# Altium schematic sheet DataPCB 2.1.SchDoc
size Tabloid portrait
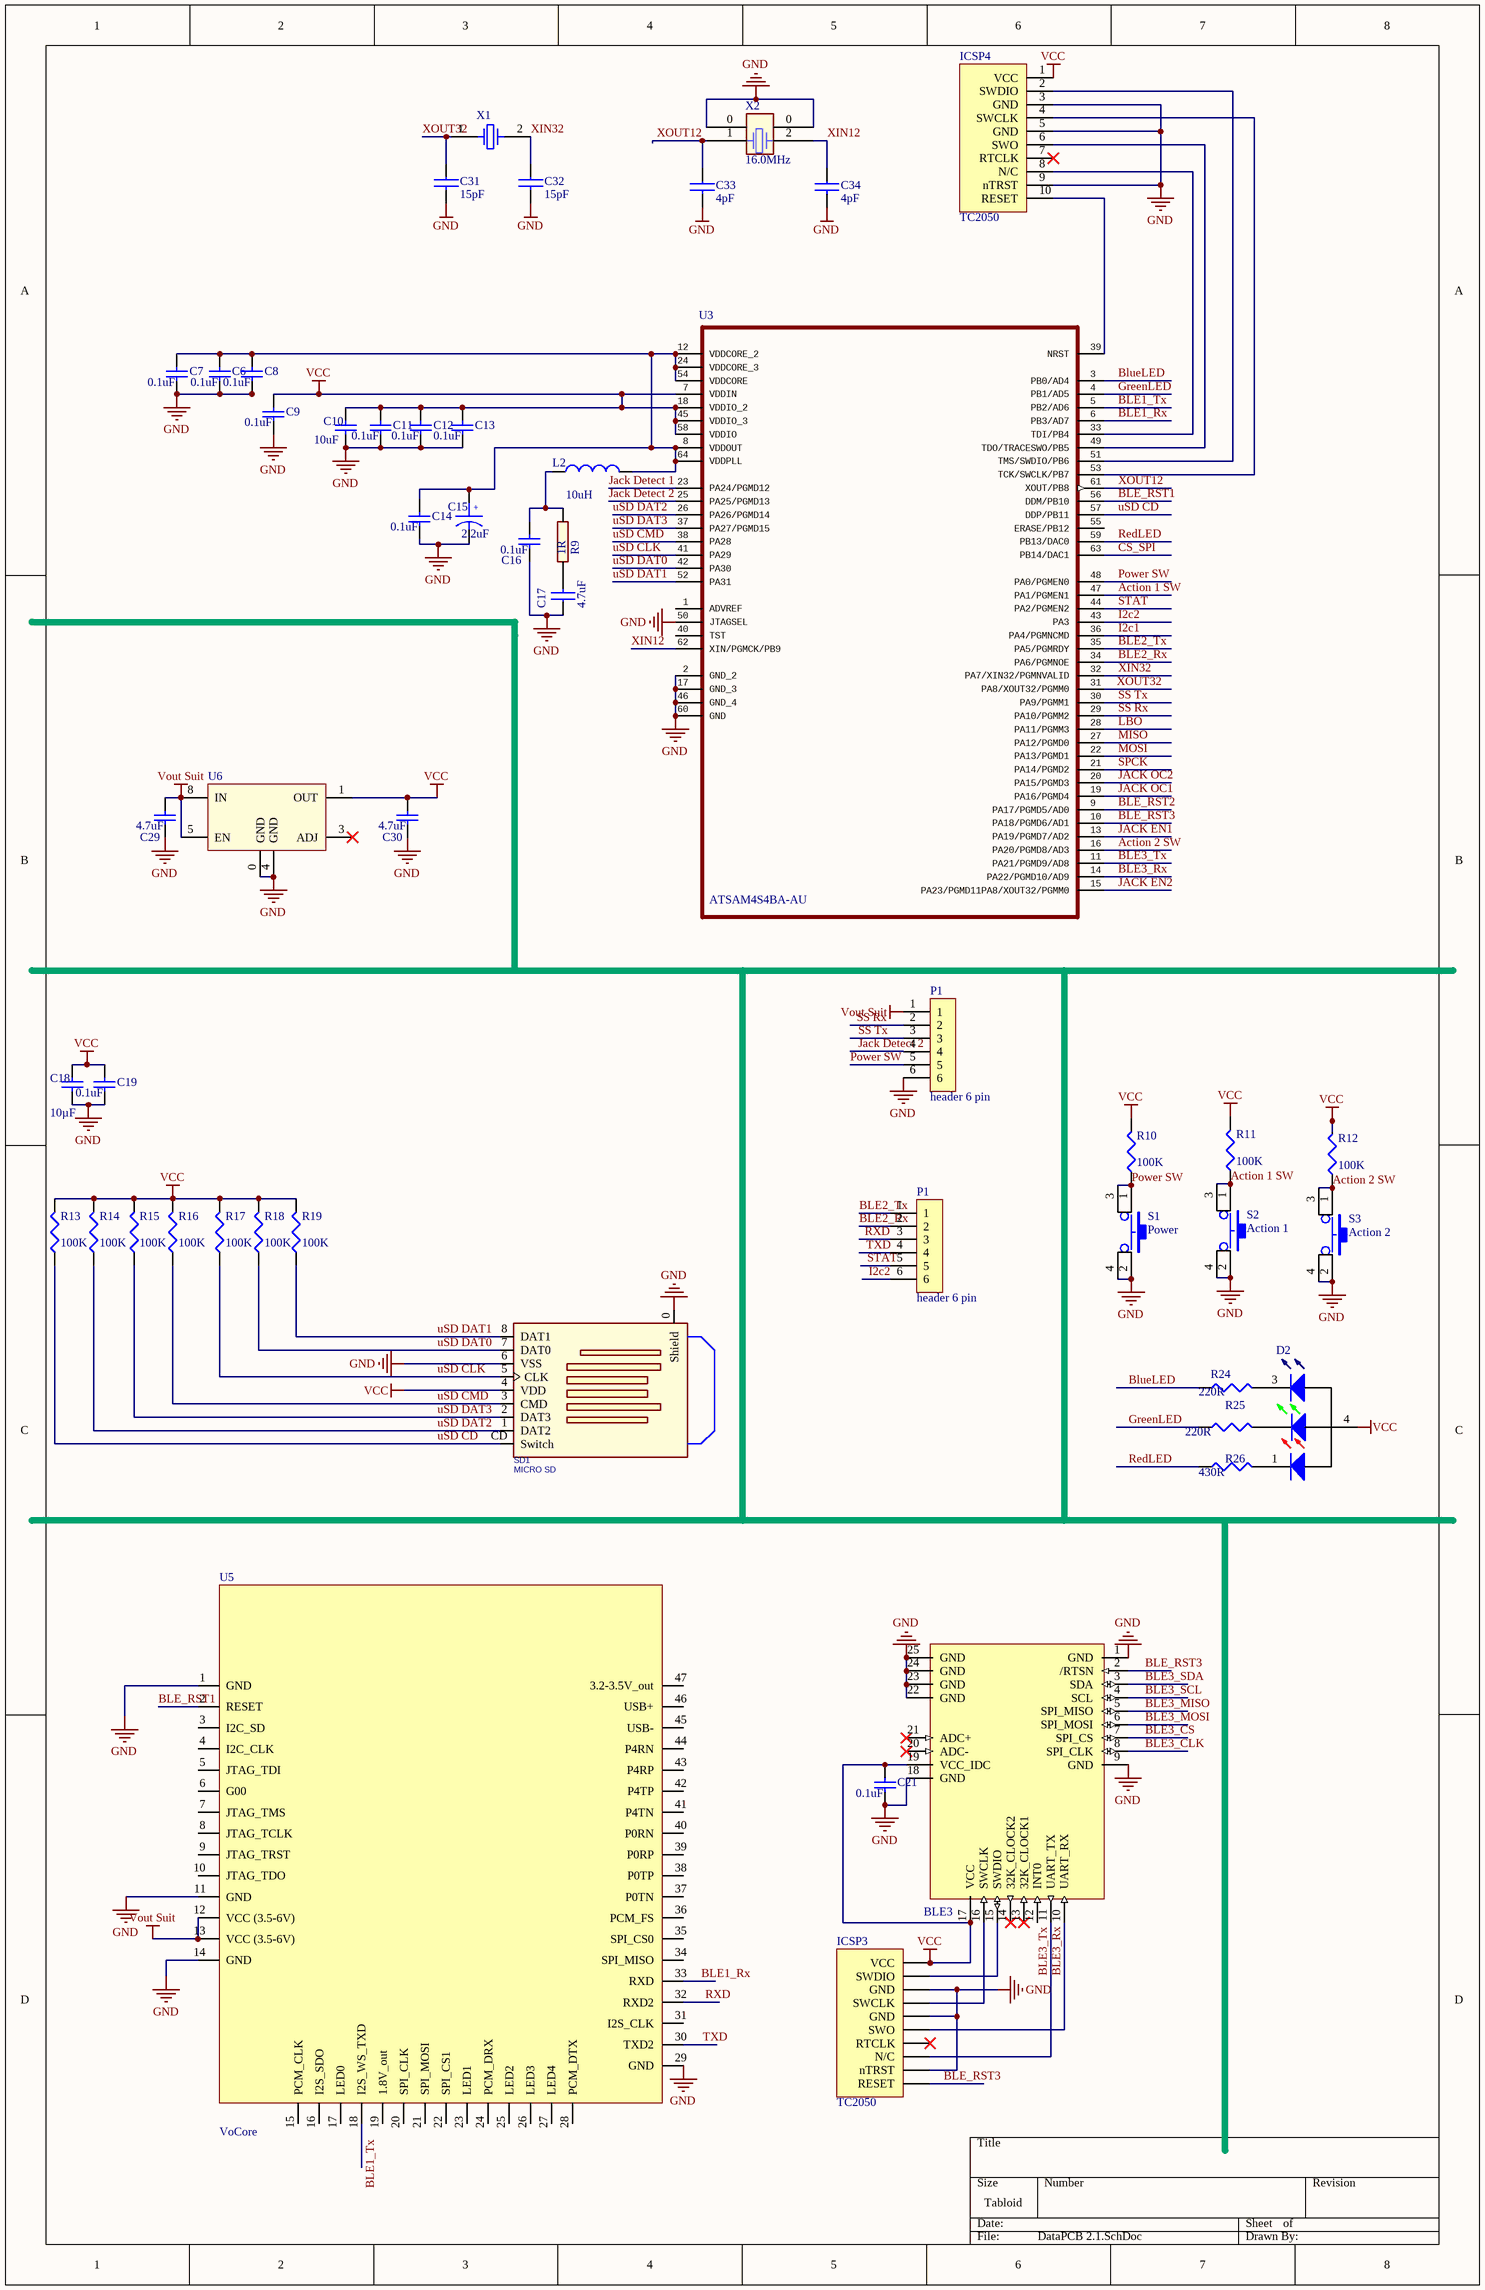
[diagram p0: DataPCB 2.1.SchDoc]

## Parts
(Parts that share a designator on the sheet are numbered #1, #2 ... from top to bottom, then left to right.)
BLE3  QS9322  [QS9322]  (value not drawn)
C6  value 0.1uF  [CAP 0402]
C7  value 0.1uF  [CAP 0402]
C8  value 0.1uF  [CAP 0402]
C9  value 0.1uF  [CAP 0402]
C10  value 10uF  [0603]
C11  value 0.1uF  [CAP 0402]
C12  value 0.1uF  [CAP 0402]
C13  value 0.1uF  [CAP 0402]
C14  value 0.1uF  [CAP 0402]
C15  value 2.2uF  [0805]
C16  value 0.1uF  [CAP 0402]
C17  value 4.7uF  [CAP 0402]
C18  value 10µF  [0603]
C19  value 0.1uF  [CAP 0402]
C21  value 0.1uF  [CAP 0402]
C29  value 4.7uF  [0603]
C30  value 4.7uF  [0603]
C31  value 15pF  [CAP 0402]
C32  value 15pF  [CAP 0402]
C33  4pF  [0603]
C34  4pF  [0603]
D2  LED2_RGB  [LED RGB]  (value not drawn)
ICSP3  TC2050  [TC2050-IDC-NL]
ICSP4  TC2050  [TC2050-IDC-NL]
L2  value 10uH  [0603]
P1#1  header 6 pin  [Header 6 1.27mm]
P1#2  header 6 pin  [Header 6 1.27mm]
R9  value 1R  [RES 0402]
R10  value 100K  [RES 0402]
R11  value 100K  [RES 0402]
R12  value 100K  [RES 0402]
R13  value 100K  [RES 0402]
R14  value 100K  [RES 0402]
R15  value 100K  [RES 0402]
R16  value 100K  [RES 0402]
R17  value 100K  [RES 0402]
R18  value 100K  [RES 0402]
R19  value 100K  [RES 0402]
R24  value 220R  [0603]
R25  value 220R  [0603]
R26  value 430R  [0603]
S1  Power  [Tac Sw RA SMT]
S2  Action 1  [Tac Sw RA SMT]
S3  Action 2  [Tac Sw RA SMT]
SD1  MICRO SD  [MICRO_SD_SMK]
U3  Manufacturer Part Number: ATSAM4S4BA-AU  [QFP50P1200X1200X160-64N]  (hidden comment: Flash MCU)
U5  VoCore  [VoCore]
U6  (no value)  [DFN8 U-DFN3030-8]
X1  Xtal 32  [Xtal smd 32khz - larger]  (value not drawn)
X2  value 16.0MHz  [Xtal smd 3.2X2.5]  (hidden comment: Xtal 16)

## Nets
GND: BLE3.1(GND) BLE3.9(GND) BLE3.18(GND) BLE3.22(GND) BLE3.23(GND) BLE3.24(GND) BLE3.25(GND) C6.2 C7.2 C8.2 C9.2 C10.2 C11.2 C12.2 C13.2 C14.2 C15.2 C16.2 C17.1 C18.2 C19.2 C21.2 C29.2 C30.2 C31.2 C32.2 C33.2 C34.2 ICSP3.3(GND) ICSP3.5(GND) ICSP3.9(nTRST) ICSP4.3(GND) ICSP4.5(GND) ICSP4.9(nTRST) P1#1.6 S1.2 S1.4 S2.2 S2.4 S3.2 S3.4 SD1.0(Shield) SD1.6(VSS) U3.2(GND_2) U3.17(GND_3) U3.46(GND_4) U3.50(JTAGSEL) U3.60(GND) U5.1(GND) U5.11(GND) U5.14(GND) U5.29(GND) U6.0(GND) U6.4(GND) X2.0
VCC: BLE3.17(VCC) BLE3.19(VCC_IDC) C9.1 C10.1 C11.1 C12.1 C13.1 C18.1 C19.1 C21.1 C30.1 D2.4 ICSP3.1(VCC) ICSP4.1(VCC) R10.2 R11.2 R12.2 R13.2 R14.2 R15.2 R16.2 R17.2 R18.2 R19.2 SD1.4(VDD) U3.7(VDDIN) U3.18(VDDIO_2) U3.45(VDDIO_3) U3.58(VDDIO) U6.1(OUT)
Vout Suit: C29.1 P1#1.1 U5.12(VCC_(3.5-6V)) U5.13(VCC_(3.5-6V)) U6.5(EN) U6.8(IN)
Action 1 SW: R11.1 S2.1 S2.3 U3.47(PA1/PGMEN1)
Action 2 SW: R12.1 S3.1 S3.3 U3.16(PA20/PGMD8/AD3)
BLE1_Rx: U3.6(PB3/AD7) U5.33(RXD)
BLE1_Tx: U3.5(PB2/AD6) U5.18(I2S_WS_TXD)
BLE2_Rx: P1#2.2 U3.34(PA6/PGMNOE)
BLE2_Tx: P1#2.1 U3.35(PA5/PGMRDY)
BLE3_CLK: BLE3.8(SPI_CLK)
BLE3_CS: BLE3.7(SPI_CS)
BLE3_MISO: BLE3.5(SPI_MISO)
BLE3_MOSI: BLE3.6(SPI_MOSI)
BLE3_Rx: BLE3.10(UART_RX) ICSP3.6(SWO) U3.14(PA22/PGMD10/AD9)
BLE3_SCL: BLE3.4(SCL)
BLE3_SDA: BLE3.3(SDA)
BLE3_Tx: BLE3.11(UART_TX) ICSP3.8(N/C) U3.11(PA21/PGMD9/AD8)
BLE_RST1: U3.56(DDM/PB10) U5.2(RESET)
BLE_RST2: U3.9(PA17/PGMD5/AD0)
BLE_RST3: BLE3.2(/RTSN) ICSP3.10(RESET) U3.10(PA18/PGMD6/AD1)
BlueLED: R24.1 U3.3(PB0/AD4)
CS_SPI: U3.63(PB14/DAC1)
GreenLED: R25.1 U3.4(PB1/AD5)
I2c1: U3.36(PA4/PGMNCMD)
I2c2: P1#2.6 U3.43(PA3)
Jack Detect 1: U3.23(PA24/PGMD12)
Jack Detect 2: P1#1.4 U3.25(PA25/PGMD13)
JACK EN1: U3.13(PA19/PGMD7/AD2)
JACK EN2: U3.15(PA23/PGMD11PA8/XOUT32/PGMM0)
JACK OC1: U3.19(PA16/PGMD4)
JACK OC2: U3.20(PA15/PGMD3)
LBO: U3.28(PA11/PGMM3)
MISO: U3.27(PA12/PGMD0)
MOSI: U3.22(PA13/PGMD1)
Power SW: P1#1.5 R10.1 S1.1 S1.3 U3.48(PA0/PGMEN0)
RedLED: R26.1 U3.59(PB13/DAC0)
RXD: P1#2.3 U5.32(RXD2)
SPCK: U3.21(PA14/PGMD2)
SS Rx: P1#1.2 U3.29(PA10/PGMM2)
SS Tx: P1#1.3 U3.30(PA9/PGMM1)
STAT: P1#2.5 U3.44(PA2/PGMEN2)
TXD: P1#2.4 U5.30(TXD2)
uSD CD: R13.1 SD1.CD(Switch) U3.57(DDP/PB11)
uSD CLK: R17.1 SD1.5(CLK) U3.41(PA29)
uSD CMD: R16.1 SD1.3(CMD) U3.38(PA28)
uSD DAT0: R18.1 SD1.7(DAT0) U3.42(PA30)
uSD DAT1: R19.1 SD1.8(DAT1) U3.52(PA31)
uSD DAT2: R14.1 SD1.1(DAT2) U3.26(PA26/PGMD14)
uSD DAT3: R15.1 SD1.2(DAT3) U3.37(PA27/PGMD15)
XIN12: C34.1 U3.62(XIN/PGMCK/PB9) X2.2
XIN32: C32.1 U3.32(PA7/XIN32/PGMNVALID) X1.2
XOUT12: C33.1 U3.61(XOUT/PB8) X2.1
XOUT32: C31.1 U3.31(PA8/XOUT32/PGMM0) X1.1
NetBLE3_15: BLE3.15(SWDIO) ICSP3.2(SWDIO)
NetBLE3_16: BLE3.16(SWCLK) ICSP3.4(SWCLK)
NetC6_1: C6.1 C7.1 C8.1 C14.1 C15.1 L2.2 U3.8(VDDOUT) U3.12(VDDCORE_2) U3.24(VDDCORE_3) U3.54(VDDCORE) U3.64(VDDPLL)
NetC16_1: C16.1 L2.1 R9.2
NetC17_2: C17.2 R9.1
NetD2_1: D2.1 R26.2
NetD2_2: D2.2 R25.2
NetD2_3: D2.3 R24.2
NetICSP4_2: ICSP4.2(SWDIO) U3.51(TMS/SWDIO/PB6)
NetICSP4_4: ICSP4.4(SWCLK) U3.53(TCK/SWCLK/PB7)
NetICSP4_6: ICSP4.6(SWO) U3.49(TDO/TRACESWO/PB5)
NetICSP4_8: ICSP4.8(N/C) U3.33(TDI/PB4)
NetICSP4_10: ICSP4.10(RESET) U3.39(NRST)

Not connected (* = marked no-connect by the designer): BLE3 12(INT0) 13(32K_CLOCK1)* 14(32K_CLOCK2)* 20(ADC-)* 21(ADC+)*; ICSP3 7(RTCLK)*; ICSP4 7(RTCLK)*; U3 1(ADVREF) 40(TST) 55(ERASE/PB12); U5 3(I2C_SD) 4(I2C_CLK) 5(JTAG_TDI) 6(G00) 7(JTAG_TMS) 8(JTAG_TCLK) 9(JTAG_TRST) 10(JTAG_TDO) 15(PCM_CLK) 16(I2S_SDO) 17(LED0) 19(1.8V_out) 20(SPI_CLK) 21(SPI_MOSI) 22(SPI_CS1) 23(LED1) 24(PCM_DRX) 25(LED2) 26(LED3) 27(LED4) 28(PCM_DTX) 31(I2S_CLK) 34(SPI_MISO) 35(SPI_CS0) 36(PCM_FS) 37(P0TN) 38(P0TP) 39(P0RP) 40(P0RN) 41(P4TN) 42(P4TP) 43(P4RP) 44(P4RN) 45(USB-) 46(USB+) 47(3.2-3.5V_out); U6 2(NC) 3(ADJ)* 6(NC) 7(NC)

## Notes on the sheet
- (in symbol A01-0492) +

## Library data of the parts
BLE3 = QS9322: QS9322 Bluetooth 4.0 Low Energy Module; Manufacturer Part Number: QS9322
C6-C9 C11-C14 C16 C19 C21 = Cap: Manufacturer: Yageo; Manufacturer Part Number: CC0402KRX5R6BB104; Capacitance: 0.1µF; Temperature Coefficient: X5R; Voltage - Rated: 10V; Tolerance: ±10%; Thickness (Max): 0.022" (0.55mm); Lead Style: -; Supplier: Digi-Key; Supplier Part Number: 311-1336-1-ND; Lead Spacing: -; Packaging: Cut Tape (CT); Category: Capacitors; Applications: General Purpose; RoHS: RoHS Compliant; Features: -; Operating Temperature: -55°C ~ 85°C; Ratings: -; Package / Case: 0402 (1005 Metric); Mounting Type: Surface Mount, MLCC; Size / Dimension: 0.039" L x 0.020" W (1.00mm x 0.50mm); Height - Seated (Max): -; ComponentLink1URL: http://www.yageo.com/documents/recent/UPY-GPHC_X5R_4V-to-50V_19.pdf; ComponentLink1Description: http://www.yageo.com/documents/recent/UPY-GPHC_X5R_4V-to-50V_19.pdf; Pricing: 1=0.14, 10=0.014, 25=0.01, 100=0.0067, 250=0.00548, 500=0.00468, 1000=0.00365, 2500=0.00328, 5000=0.00304 (CAD)
C10 = Cap: Manufacturer Part Number: GRM188R61C106MA73D; Manufacturer: Murata Electronics North America; Capacitance: 10µF; Temperature Coefficient: X5R; Voltage - Rated: 16V; Tolerance: ±20%; Lead Spacing: -; Applications: General Purpose; Height - Seated (Max): -; Supplier Part Number: 490-7201-1-ND; Package / Case: 0603 (1608 Metric); Mounting Type: Surface Mount, MLCC; Lead Style: -; Packaging: Cut Tape (CT); Operating Temperature: -55°C ~ 85°C; Category: Capacitors; Size / Dimension: 0.063" L x 0.031" W (1.60mm x 0.80mm); Ratings: -; Supplier: Digi-Key; Thickness (Max): 0.031" (0.80mm); RoHS: RoHS Compliant; Features: -; ComponentLink1URL: http://www.murata.com/~/media/webrenewal/support/library/catalog/products/capacitor/mlcc/c02e.ashx; ComponentLink1Description: http://www.murata.com/~/media/webrenewal/support/library/catalog/products/capacitor/mlcc/c02e.ashx; Pricing: 1=0.25, 10=0.234, 25=0.1996, 50=0.1698, 100=0.1632, 250=0.14652, 500=0.13986, 1000=0.11655 (CAD)
C15 = A01-0492: Manufacturer Size Code: P; Manufacturer: AVX Corporation; Manufacturer Part Number: F921A225MPA; Tolerance: ±20%; Type: Molded; ESR (Equivalent Series Resistance): 12 Ohm; Capacitance: 2.2µF; Voltage - Rated: 10V; Category: Capacitors; Size / Dimension: 0.079" L x 0.049" W (2.00mm x 1.25mm); RoHS: RoHS Compliant; Operating Temperature: -55°C ~ 125°C; Mounting Type: Surface Mount; Package / Case: 0805 (2012 Metric); Height - Seated (Max): 0.039" (1.00mm); Lifetime @ Temp.: -; Supplier: Digi-Key; Packaging: Cut Tape (CT); Features: General Purpose; Lead Spacing: -; Supplier Part Number: 478-8123-1-ND; ComponentLink1URL: http://www.avx.com/docs/Catalogs/f92.pdf; ComponentLink1Description: http://www.avx.com/docs/Catalogs/f92.pdf; Pricing: 1=0.45, 10=0.397, 100=0.1983, 250=0.15856, 500=0.14442, 1000=0.13025 (CAD)
C17 = A01-0046: Manufacturer: Murata Electronics North America; Manufacturer Part Number: ZRB15XR61A475ME01D; Temperature Coefficient: X5R; Voltage - Rated: 10V; Capacitance: 4.7µF; Tolerance: ±20%; Features: -; Lead Style: -; Mounting Type: Surface Mount, MLCC; Applications: General Purpose; Ratings: -; Height - Seated (Max): -; Supplier Part Number: 490-10984-1-ND; Package / Case: 0402 (1005 Metric); Supplier: Digi-Key; Thickness (Max): 0.031" (0.80mm); Category: Capacitors; RoHS: RoHS Compliant; Size / Dimension: 0.039" L x 0.020" W (1.00mm x 0.50mm); Lead Spacing: -; Packaging: Cut Tape (CT); Operating Temperature: -55°C ~ 85°C; ComponentLink1URL: http://search.murata.co.jp/Ceramy/image/img/A01X/G101/ENG/ZRB15XR61A475ME01-01.pdf; ComponentLink1Description: http://search.murata.co.jp/Ceramy/image/img/A01X/G101/ENG/ZRB15XR61A475ME01-01.pdf; Pricing: 1=0.5, 10=0.418, 50=0.2354, 100=0.2092, 250=0.15688, 500=0.1386, 1000=0.12289 (CAD)
C18 = Cap: Manufacturer Part Number: GRM188R61C106MA73D; Manufacturer: Murata Electronics North America; Voltage - Rated: 16V; Temperature Coefficient: X5R; Tolerance: ±20%; Pricing: 1=0.25, 10=0.234, 25=0.1996, 50=0.1698, 100=0.1632, 250=0.14652, 500=0.13986, 1000=0.11655 (CAD); ComponentLink1URL: http://www.murata.com/~/media/webrenewal/support/library/catalog/products/capacitor/mlcc/c02e.ashx; ComponentLink1Description: http://www.murata.com/~/media/webrenewal/support/library/catalog/products/capacitor/mlcc/c02e.ashx; Lead Spacing: -; Capacitance: 10µF; Applications: General Purpose; Height - Seated (Max): -; Supplier Part Number: 490-7201-1-ND; Package / Case: 0603 (1608 Metric); Mounting Type: Surface Mount, MLCC; Lead Style: -; Packaging: Cut Tape (CT); Operating Temperature: -55°C ~ 85°C; Category: Capacitors; Size / Dimension: 0.063" L x 0.031" W (1.60mm x 0.80mm); Ratings: -; Supplier: Digi-Key; Thickness (Max): 0.031" (0.80mm); RoHS: RoHS Compliant; Features: -
C29 C30 = Cap: Manufacturer: Yageo; Manufacturer Part Number: CC0603KRX5R6BB475; Tolerance: ±10%; Capacitance: 4.7µF; Voltage - Rated: 10V; Temperature Coefficient: X5R; Published: 8-Jun-2000; LatestRevisionDate: 17-Jul-2002; LatestRevisionNote: Re-released for DXP Platform.; PackageReference: RAD-0.3; Publisher: Altium Limited; Features: -; Height - Seated (Max): -; Operating Temperature: -55°C ~ 85°C; Mounting Type: Surface Mount, MLCC; Category: Capacitors; RoHS: RoHS Compliant; Packaging: Cut Tape (CT); Supplier: Digi-Key; Thickness (Max): 0.035" (0.90mm); Supplier Part Number: 311-1455-1-ND; Ratings: -; Package / Case: 0603 (1608 Metric); Lead Style: -; Size / Dimension: 0.063" L x 0.031" W (1.60mm x 0.80mm); Applications: General Purpose; Lead Spacing: -; ComponentLink1URL: http://www.yageo.com/documents/recent/UPY-GPHC_X5R_4V-to-50V_19.pdf; ComponentLink1Description: http://www.yageo.com/documents/recent/UPY-GPHC_X5R_4V-to-50V_19.pdf; Pricing: 1=0.2, 10=0.133, 25=0.1, 100=0.0633, 250=0.05336, 500=0.04468, 1000=0.03669 (CAD)
C31 = A01-0013: Manufacturer Part Number: GJM1555C1H150JB01D; Manufacturer: Murata Electronics North America; Tolerance: ±5%; Voltage - Rated: 50V; Temperature Coefficient: C0G, NP0; Lead Style: -; Packaging: Cut Tape (CT); Height - Seated (Max): -; Capacitance: 15pF; Thickness (Max): 0.022" (0.55mm); Features: High Q, Low Loss; Ratings: -; Size / Dimension: 0.039" L x 0.020" W (1.00mm x 0.50mm); Operating Temperature: -55°C ~ 125°C; RoHS: RoHS Compliant; Mounting Type: Surface Mount, MLCC; Package / Case: 0402 (1005 Metric); Supplier Part Number: 490-3117-1-ND; Category: Capacitors; Applications: RF, Microwave, High Frequency; Lead Spacing: -; Supplier: Digi-Key
C32 = A01-0013: Manufacturer Part Number: GJM1555C1H150JB01D; Manufacturer: Murata Electronics North America; Voltage Rating DC: 50 V; Tolerance: ±5%; Voltage - Rated: 50V; Temperature Coefficient: C0G, NP0; Lead Style: -; Packaging: Cut Tape (CT); Height - Seated (Max): -; Capacitance: 15pF; Thickness (Max): 0.022" (0.55mm); Features: High Q, Low Loss; Ratings: -; Size / Dimension: 0.039" L x 0.020" W (1.00mm x 0.50mm); Operating Temperature: -55°C ~ 125°C; RoHS: RoHS Compliant; Mounting Type: Surface Mount, MLCC; Package / Case: 0402 (1005 Metric); Supplier Part Number: 490-3117-1-ND; Category: Capacitors; Applications: RF, Microwave, High Frequency; Lead Spacing: -; Supplier: Digi-Key
C33 C34 = A01-0018: Manufacturer Part Number: CBR06C409BAGAC; Manufacturer: Kemet; Tolerance: ±0.1pF; Temperature Coefficient: C0G, NP0; Voltage - Rated: 250V; Value: 4pF; Supplier Part Number: 399-8736-1-ND; ComponentLink1URL: http://www.kemet.com/Lists/ProductCatalog/Attachments/490/KEM_C1030_CBR_SMD.pdf; ComponentLink1Description: http://www.kemet.com/Lists/ProductCatalog/Attachments/490/KEM_C1030_CBR_SMD.pdf; Category: Capacitors; Supplier: Digi-Key; Ratings: -; Capacitance: 4pF; Applications: RF, Microwave, High Frequency; Package / Case: 0603 (1608 Metric); Mounting Type: Surface Mount, MLCC; Thickness (Max): 0.034" (0.87mm); Packaging: Cut Tape (CT); Operating Temperature: -55°C ~ 125°C; Size / Dimension: 0.063" L x 0.031" W (1.60mm x 0.80mm); Features: High Q, Low Loss; Height - Seated (Max): -; Lead Spacing: -; RoHS: RoHS Compliant; Lead Style: -
  C33: Pricing: 1=0.5, 10=0.445, 50=0.2698, 100=0.2222, 250=0.17776, 500=0.1619, 1000=0.14601 (CAD)
D2 = LED2_RGB: RGB Led; Manufacturer Part Number: LTST-C19HE1WT; Manufacturer: Lite-On Inc; Lens Transparency: Diffused; Millicandela Rating: 112.5mcd Red, 281mcd Green, 104mcd Blue; Wavelength - Dominant: 624nm Red, 525nm Green, 470nm Blue; Wavelength - Peak: 632nm Red, 520nm Green, 468nm Blue; Lens Color: White; Current - Test: 20mA Red, 20mA Green, 20mA Blue; Voltage - Forward (Vf) (Typ): 2.1V Red, 3.35V Green, 3.35V Blue; Color: Red, Green, Blue (RGB); Lens Style/Size: Rectangle with Flat Top, 1.15mm x 1.60mm; Viewing Angle: 130°; Package / Case: 0606 (1616 Metric); Supplier: Digi-Key; Height (Max): 0.35mm; Size / Dimension: 1.60mm L x 1.60mm W; RoHS: RoHS Compliant; Mounting Type: Surface Mount; Category: Optoelectronics; Packaging: Cut Tape (CT); Supplier Device Package: *; Pricing: 1=0.82, 10=0.632, 100=0.4097, 250=0.35112, 500=0.3043, 1000=0.23407 (CAD); ComponentLink1URL: http://optoelectronics.liteon.com/upload/download/DS22-2008-0044/S_110_LTST-C19HE1WT.pdf; ComponentLink1Description: http://optoelectronics.liteon.com/upload/download/DS22-2008-0044/S_110_LTST-C19HE1WT.pdf; Supplier Part Number: 160-2162-1-ND
ICSP3 ICSP4 = TC2050: ICSP Header
L2 = Inductor: Manufacturer Part Number: AIML-0603-100K-T; Manufacturer: Abracon LLC; Frequency - Test: 2MHz; Tolerance: ±10%; Q @ Freq: 35 @ 2MHz; Frequency - Self Resonant: 33GHz; Inductance: 10µH; DC Resistance (DCR): 2.55 Ohm Max; Shielding: Shielded; Type: Multilayer; Material - Core: Ferrite; Current Rating: 3mA; Packaging: Cut Tape (CT); Supplier: Digi-Key; Mounting Type: Surface Mount; Current - Saturation: -; Supplier Device Package: 0603 (1608 Metric); RoHS: RoHS Compliant; Package / Case: 0603 (1608 Metric); Height - Seated (Max): 0.039" (0.95mm); Size / Dimension: 0.063" L x 0.031" W (1.60mm x 0.80mm); Supplier Part Number: 535-11587-1-ND; Operating Temperature: -55°C ~ 125°C; Category: Inductors, Coils, Chokes; ComponentLink1URL: http://www.abracon.com/Magnetics/new/AIML-0603.pdf; ComponentLink1Description: http://www.abracon.com/Magnetics/new/AIML-0603.pdf; Pricing: 1=0.14, 10=0.133, 25=0.1196, 50=0.1038, 100=0.093, 500=0.0797, 750=0.07571, 1000=0.06907 (CAD)
R9 = A02-0284: Manufacturer: Samsung Electro-Mechanics America, Inc.; Manufacturer Part Number: RC1005F1R0CS; Tolerance: ±1%; Power (Watts): 0.063W, 1/16W; Resistance (Ohms): 1; Temperature Coefficient: ±300ppm/°C; Supplier: Digi-Key; Number of Terminations: 2; Category: Resistors; Operating Temperature: -55°C ~ 155°C; Features: -; Composition: Thick Film; Packaging: Cut Tape (CT); Height: 0.016" (0.40mm); Package / Case: 0402 (1005 Metric); RoHS: RoHS Compliant; Supplier Device Package: 0402 (1005 Metric); Supplier Part Number: 1276-3858-1-ND; Size / Dimension: 0.039" L x 0.020" W (1.00mm x 0.50mm); ComponentLink1URL: http://www.samsungsem.com/global/support/library/product-catalog/__icsFiles/afieldfile/2015/01/12/CHIP_RESISTOR_150112_1.pdf; ComponentLink1Description: http://www.samsungsem.com/global/support/library/product-catalog/__icsFiles/afieldfile/2015/01/12/CHIP_RESISTOR_150112_1.pdf; Pricing: 1=0.15, 10=0.019, 25=0.0144, 50=0.011, 100=0.008, 250=0.00612, 500=0.00488, 1000=0.0036, 2500=0.00313 (CAD)
R10-R19 = Res3: Manufacturer Part Number: CRG0402J100K/10; Manufacturer: TE Connectivity AMP Connectors; Tolerance: ±5%; Power (Watts): 0.063W, 1/16W; Temperature Coefficient: ±200ppm/°C; Operating Temperature: -55°C ~ 125°C; Resistance (Ohms): 100k; Height: 0.016" (0.40mm); Size / Dimension: 0.039" L x 0.020" W (1.00mm x 0.50mm); Category: Resistors; Supplier Device Package: 0402; RoHS: RoHS Compliant; Features: -; Packaging: Cut Tape (CT); Supplier: Digi-Key; Composition: Thick Film; Supplier Part Number: A121521CT-ND; Number of Terminations: 2; Package / Case: 0402 (1005 Metric); ComponentLink1URL: http://www.te.com/commerce/DocumentDelivery/DDEController?Action=srchrtrv&DocNm=1773204&DocType=DS&DocLang=English; ComponentLink1Description: http://www.te.com/commerce/DocumentDelivery/DDEController?Action=srchrtrv&DocNm=1773204&DocType=DS&DocLang=English; Pricing: 1=0.15, 10=0.015, 25=0.0108, 50=0.0084, 100=0.0063, 250=0.00472, 500=0.00378, 1000=0.00278, 2500=0.00241 (CAD)
R24 R25 = Res3: Resistor; Manufacturer Part Number: ESR03EZPJ221; Manufacturer: Rohm Semiconductor; Power (Watts): 0.25W, 1/4W; Resistance (Ohms): 220; Temperature Coefficient: ±200ppm/°C; Tolerance: ±5%; Package / Case: 0603 (1608 Metric); Number of Terminations: 2; Features: Automotive AEC-Q200, Pulse Withstanding; Packaging: Cut Tape (CT); Supplier: Digi-Key; Size / Dimension: 0.063" L x 0.031" W (1.60mm x 0.80mm); Supplier Part Number: RHM220DCT-ND; Height: 0.022" (0.55mm); Composition: Thick Film; RoHS: RoHS Compliant; Supplier Device Package: 0603 (1608 Metric); Operating Temperature: -55°C ~ 155°C; Category: Resistors; ComponentLink1URL: http://rohmfs.rohm.com/en/products/databook/datasheet/passive/resistor/chip_resistor/esr.pdf; ComponentLink1Description: http://rohmfs.rohm.com/en/products/databook/datasheet/passive/resistor/chip_resistor/esr.pdf; Pricing: 1=0.15, 10=0.118, 25=0.0812, 100=0.0451, 250=0.03516, 500=0.02794, 1000=0.01982 (CAD)
R26 = Res3: Resistor; Manufacturer Part Number: ESR03EZPJ431; Manufacturer: Rohm Semiconductor; Temperature Coefficient: ±200ppm/°C; Power (Watts): 0.25W, 1/4W; Tolerance: ±5%; Resistance (Ohms): 430; Supplier Part Number: RHM430DCT-ND; Composition: Thick Film; Features: Automotive AEC-Q200, Pulse Withstanding; Supplier Device Package: 0603 (1608 Metric); Number of Terminations: 2; Supplier: Digi-Key; Size / Dimension: 0.063" L x 0.031" W (1.60mm x 0.80mm); Operating Temperature: -55°C ~ 155°C; Height: 0.022" (0.55mm); Packaging: Cut Tape (CT); Package / Case: 0603 (1608 Metric); RoHS: RoHS Compliant; Category: Resistors; ComponentLink1URL: http://rohmfs.rohm.com/en/products/databook/datasheet/passive/resistor/chip_resistor/esr.pdf; ComponentLink1Description: http://rohmfs.rohm.com/en/products/databook/datasheet/passive/resistor/chip_resistor/esr.pdf; Pricing: 1=0.15, 10=0.118, 25=0.0812, 100=0.0451, 250=0.03516, 500=0.02794, 1000=0.01982 (CAD)
S1-S3 = SW PUSHBUTTON: SWITCH TACT 2.36MM SILV J-LEAD; Manufacturer: TE Connectivity Alcoswitch Switches; MPN: KT11P2JM34LFS; Manufacturer Part Number: 1571262-2; Value: Tact Switch; Populate: Y; Operating Force: 220gf; Actuator Orientation: Side Actuated; Circuit: SPST-NO; Actuator Type: Rectangular Button; Actuator Material: Liquid Crystal Polymer (LCP); Switch Function: Off-Mom; Outline: 5.60mm x 4.00mm; Illumination: Non-Illuminated; Mechanical Life: 50,000 Cycles; Contact Rating @ Voltage: 0.05A @ 12VDC; DigiKeyPartNumber: KT11P2JM, KT11P2JM34LFS; SMT: Y; PartType: Switch; Pricing: 1=4.01, 10=3.856, 25=3.5484, 50=3.0854, 100=2.9312, 250=2.85404, 500=2.7769, 3300=2.15982 (CAD); Actuator Height off PCB, from Pins: -; RoHS: RoHS Compliant; Packaging: Cut Tape (CT); Ingress Protection: -; Supplier Part Number: 450-2060-1-ND; Features: -; Operating Temperature: -20°C ~ 70°C; Illumination Voltage (Nominal): -; Termination Style: Gull Wing; Illumination Type, Color: -; Switch Travel: -; Supplier: Digi-Key; Mounting Type: Surface Mount, Right Angle; Category: Switches
SD1 = MICRO SD SMK: Manufacturer Part Number: CLE9108-8A93E; Manufacturer: SMK; Supplier Part Number: CLE9108-8A93E
U3 = ATSAM3S4BA-AU: Manufacturer: Atmel; Oscillator Type: Internal; Core Size: 32-Bit; Data Converters: A/D 11x12b, D/A 2x12b; Peripherals: Brown-out Detect/Reset, DMA, POR, PWM, WDT; RAM Size: 64K x 8; Number of I/O: 47; Voltage - Supply (Vcc/Vdd): 1.62 V ~ 3.6 V; Speed: 120MHz; Program Memory Size: 256KB (256K x 8); Core Processor: ARM® Cortex®-M4; Connectivity: I²C, IrDA, Memory Card, SPI, SSC, UART/USART, USB; OC_FARNELL: 1841656; OC_NEWARK: 12T1314; PACKAGE: QFP-64; Supplier: Digi-Key; ComponentLink1URL: http://www.atmel.com/images/11177d-atarm4s_e_us_121013_web%20final.pdf; ComponentLink1Description: http://www.atmel.com/images/11177d-atarm4s_e_us_121013_web%20final.pdf; Pricing: 1=9.16, 10=8.24, 100=6.7749, 250=6.22556, 500=5.67624, 1000=5.08623 (CAD); Supplier Device Package: 64-LQFP (10x10); Supplier Part Number: ATSAM4S4BA-AU-ND; Category: Integrated Circuits (ICs); EEPROM Size: -; Packaging: Tray; Operating Temperature: -40°C ~ 85°C; Package / Case: 64-LQFP; Program Memory Type: FLASH; RoHS: RoHS Compliant
U6 = AP7361-33FGE-7 LDO 3.3V: IC REG LDO 3.3V 1A 8DFN; Manufacturer: Diodes Incorporated; Voltage - Dropout (Typical): 0.5V @ 1A; Voltage - Input: Up to 6V; Number of Regulators: 1; Current - Limit (Min): 1.1A; Regulator Topology: Positive Fixed; Supplier 1: Digi-Key; Package / Case: 8-UDFN Exposed Pad; Manufacturer Part Number: AP7361-33FGE-7; Supplier: Digi-Key; Supplier Device Package: 8-UDFN3030; Category: Integrated Circuits (ICs); Operating Temperature: -40°C ~ 85°C; Current - Output: 1A; Voltage - Output: 3.3V; Packaging: Cut Tape (CT); RoHS: RoHS Compliant; Mounting Type: Surface Mount; Pricing: 1=0.82, 10=0.691, 25=0.6056, 100=0.5185, 250=0.44968, 500=0.3809, 1000=0.29364 (CAD); ComponentLink1URL: http://www.diodes.com/datasheets/AP7361.pdf; ComponentLink1Description: http://www.diodes.com/datasheets/AP7361.pdf; Supplier Part Number: AP7361-33FGE-7DICT-ND
X1 = Xtal 32: Manufacturer Part Number: ST3215SB32768E0HPWBB; Manufacturer: AVX Corp/Kyocera Corp; Load Capacitance: 9pF; Frequency Tolerance: ±20ppm; Operating Mode: Fundamental; ESR (Equivalent Series Resistance): 70 kOhm; Frequency Stability: ±200ppm; Frequency: 32.768kHz; Pricing: 1=1.13, 10=1.01, 50=0.9422, 100=0.8338, 500=0.78798, 750=0.74628, 1000=0.65873 (CAD); ComponentLink1URL: http://www.kyocera-crystal.jp/eng/wp-content/uploads/2014/09/st3215sb_e.pdf; ComponentLink1Description: http://www.kyocera-crystal.jp/eng/wp-content/uploads/2014/09/st3215sb_e.pdf; Mounting Type: Surface Mount; RoHS: RoHS Compliant; Ratings: -; Operating Temperature: -40°C ~ 85°C; Type: kHz Crystal (Tuning Fork); Size / Dimension: 0.126" L x 0.059" W (3.20mm x 1.50mm); Height: 0.035" (0.90mm); Category: Crystals and Oscillators; Package / Case: 2-SMD, No Lead (DFN, LCC); Packaging: Cut Tape (CT); Supplier Part Number: 1253-1335-1-ND; Supplier: Digi-Key
X2 = Xtal 12: Manufacturer Part Number: CX3225CA16000H0HSSCC; Manufacturer: AVX Corp/Kyocera Corp; Frequency Tolerance: ±20ppm; Operating Mode: Fundamental; Load Capacitance: 12pF; Frequency Stability: ±50ppm; ESR (Equivalent Series Resistance): 100 Ohm; Frequency: 16MHz; ComponentLink1URL: http://media.digikey.com/pdf/Data%20Sheets/AVX%20PDFs/CX3225CA16000H0HSSCC_Spec.pdf; ComponentLink1Description: http://media.digikey.com/pdf/Data%20Sheets/AVX%20PDFs/CX3225CA16000H0HSSCC_Spec.pdf; Pricing: 1=1.34, 10=1.19, 50=1.1104, 100=0.9827, 500=0.92868, 750=0.87956, 1000=0.77636 (CAD); Package / Case: 4-SMD, No Lead (DFN, LCC); Mounting Type: Surface Mount; Operating Temperature: -40°C ~ 125°C; RoHS: RoHS Compliant; Supplier Part Number: 1253-1139-1-ND; Supplier: Digi-Key; Size / Dimension: 0.126" L x 0.098" W (3.20mm x 2.50mm); Ratings: AEC-Q200; Packaging: Cut Tape (CT); Height: 0.035" (0.90mm); Type: MHz Crystal; Category: Crystals and Oscillators